# EasyEDA Pro project 控制箱转接板.eprj

# Schematic 控制箱转接板
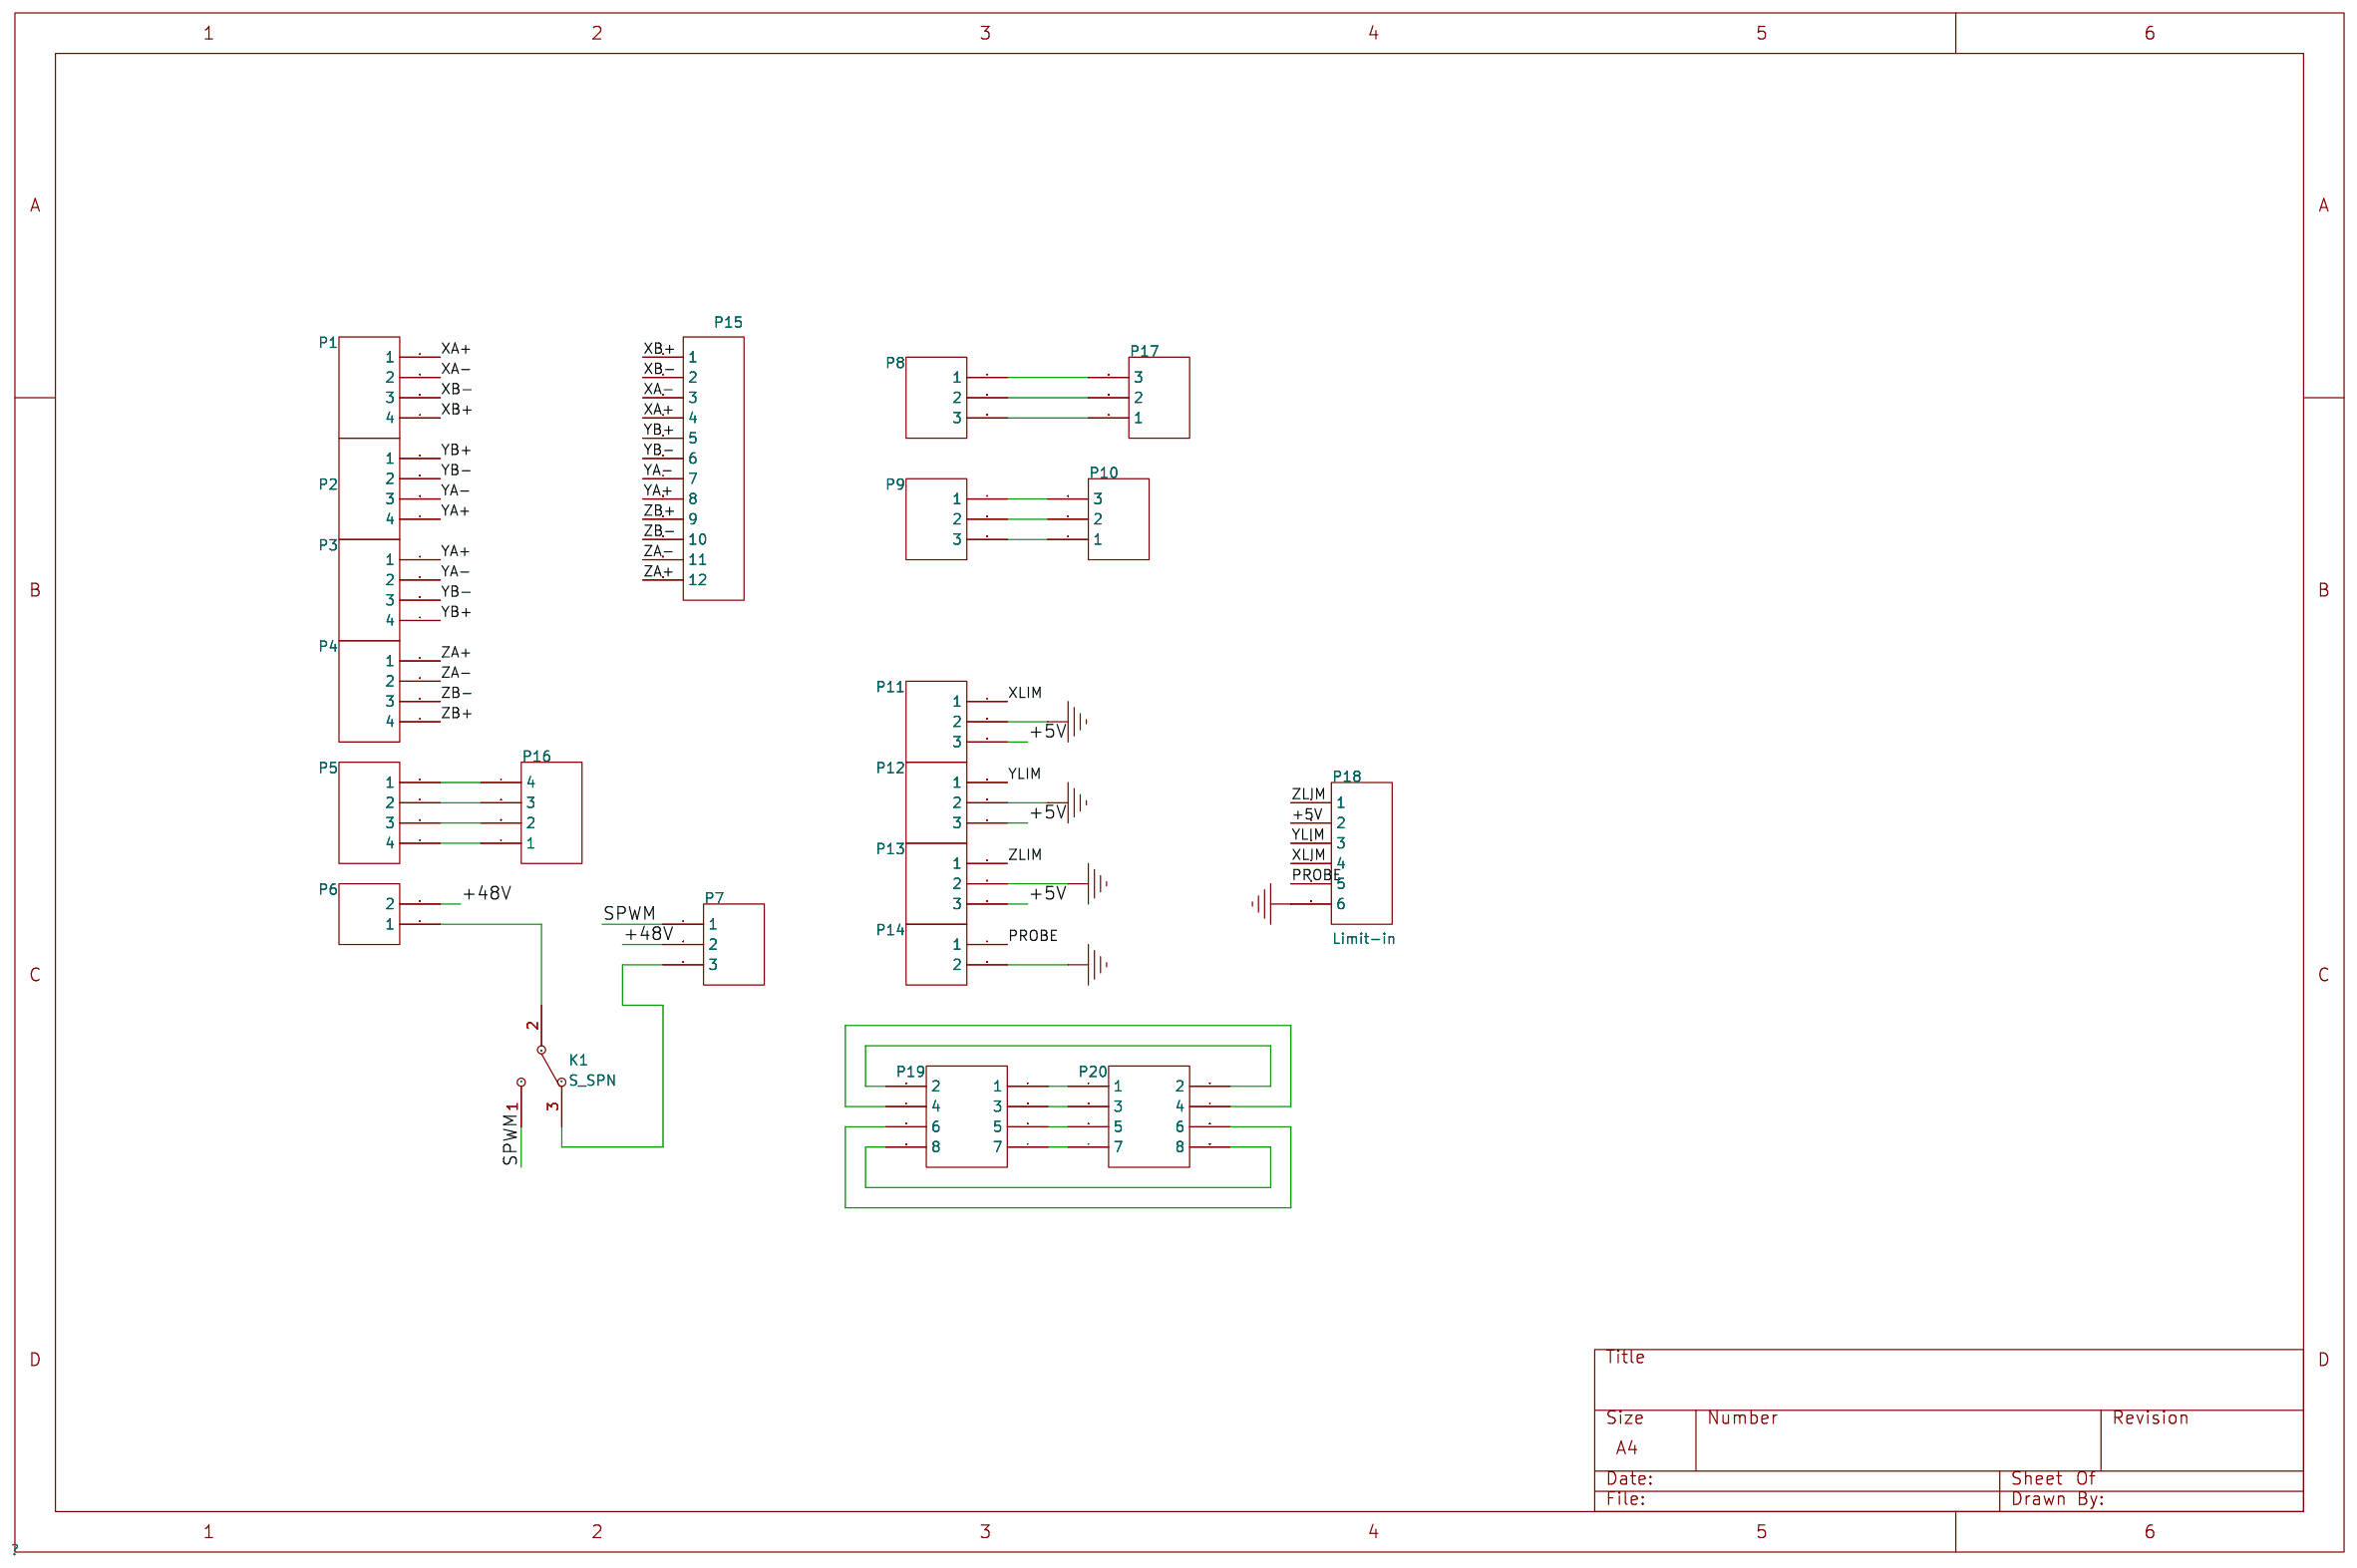
[diagram p0: schematic sheet]

## Parts
K1  S_SPN  [SW-TH_SS-12D10L3]
P1  X-out  [CONN-TH_4P-P5.00_KF2EDGVC-5.08-4P]
P2  Y1-out  [CONN-TH_4P-P5.00_KF2EDGVC-5.08-4P]
P3  Y2-out  [CONN-TH_4P-P5.00_KF2EDGVC-5.08-4P]
P4  Z-out  [CONN-TH_4P-P5.00_KF2EDGVC-5.08-4P]
P5  Aout  [CONN-TH_4P-P5.00_KF2EDGVC-5.08-4P]
P6  SPN-out  [CONN-TH_2P-P5.00_KF2EDGVC-5.08-2P]
P7  SPN-in  [CONN-TH_3P-P5.00_KF2EDGVC-5.08-3P]
P8  Laser-out  [CONN-TH_3P-P5.00_KF2EDGVC-5.08-3P]
P9  BL-out  [CONN-TH_3P-P5.00_KF2EDGVC-5.08-3P]
P10  BL-in  [CONN-TH_3P-P5.00_KF2EDGVC-5.08-3P]
P11  XLimt-out  [CONN-TH_3P-P5.00_KF2EDGVC-5.08-3P]
P12  YLimt-out  [CONN-TH_3P-P5.00_KF2EDGVC-5.08-3P]
P13  ZLimt-out  [CONN-TH_3P-P5.00_KF2EDGVC-5.08-3P]
P14  Probe-out  [CONN-TH_2P-P5.00_KF2EDGVC-5.08-2P]
P15  XYZAxis  [HDR1X12_CON]
P16  Ain  [HDR1X4_CON]
P17  Laser-in  [HDR1X3_CON]
P18  Limit-in  [HDR1X6_CON]
P19  Offline-out  [IDC-TH_MTB110-08S - duplicate]
P20  Offline-in  [IDC-TH_MTB110-08S - duplicate]

## Library data of the parts
K1 = S_SPN: SS-12D10L5; Published: 24-Mar-1999; LatestRevisionDate: 17-Dec-2003; LatestRevisionNote: Schematic revised, PCB Footprint replaced.; DatasheetVersion: 05-Dec-2000; PackageReference: TL36WW15050; Publisher: Altium Limited; PackageDescription: Switch; 4 Leads; ComponentLink1Description: Manufacturer Link; ComponentLink1URL: http://www.apem.com; Design Item ID: SW-SPDT; Library Name: Miscellaneous Devices
P1 = X-out: KF2EDGVC-5.0-4P，直插; LatestRevisionDate: 17-Jul-2002; LatestRevisionNote: Re-released for DXP Platform.; Publisher: Altium Limited; Origin Footprint 2: HDR1X4H; Origin Footprint 3: CONN-TH_4P-P3.81_KF2EDGV-3.81-4P; Origin Footprint 1: CONN-TH_4P-P5.00_KF2EDGVC-5.0-4P; Design Item ID: Header 4H; Library Name: Miscellaneous Connectors
P2 = Y1-out: KF2EDGVC-5.0-4P，直插; LatestRevisionDate: 17-Jul-2002; LatestRevisionNote: Re-released for DXP Platform.; Publisher: Altium Limited; Origin Footprint 2: HDR1X4H; Origin Footprint 3: CONN-TH_4P-P3.81_KF2EDGV-3.81-4P; Origin Footprint 1: CONN-TH_4P-P5.00_KF2EDGVC-5.0-4P; Design Item ID: Header 4H; Library Name: Miscellaneous Connectors
P3 = Y2-out: KF2EDGVC-5.0-4P，直插; LatestRevisionDate: 17-Jul-2002; LatestRevisionNote: Re-released for DXP Platform.; Publisher: Altium Limited; Origin Footprint 2: HDR1X4H; Origin Footprint 3: CONN-TH_4P-P3.81_KF2EDGV-3.81-4P; Origin Footprint 1: CONN-TH_4P-P5.00_KF2EDGVC-5.0-4P; Design Item ID: Header 4H; Library Name: Miscellaneous Connectors
P4 = Z-out: KF2EDGVC-5.0-4P，直插; LatestRevisionDate: 17-Jul-2002; LatestRevisionNote: Re-released for DXP Platform.; Publisher: Altium Limited; Origin Footprint 2: HDR1X4H; Origin Footprint 3: CONN-TH_4P-P3.81_KF2EDGV-3.81-4P; Origin Footprint 1: CONN-TH_4P-P5.00_KF2EDGVC-5.0-4P; Design Item ID: Header 4H; Library Name: Miscellaneous Connectors
P5 = Aout: KF2EDGVC-5.0-4P，直插; LatestRevisionDate: 17-Jul-2002; LatestRevisionNote: Re-released for DXP Platform.; Publisher: Altium Limited; Origin Footprint 2: HDR1X4H; Origin Footprint 3: CONN-TH_4P-P3.81_KF2EDGV-3.81-4P; Origin Footprint 1: CONN-TH_4P-P5.00_KF2EDGVC-5.0-4P; Design Item ID: Header 4H; Library Name: Miscellaneous Connectors
P6 = SPN-out: KF2EDGVC-5.0-2P，直插; LatestRevisionDate: 17-Jul-2002; LatestRevisionNote: Re-released for DXP Platform.; Publisher: Altium Limited; Origin Footprint 2: HDR1X2H; Origin Footprint 3: CONN-TH_2P-P3.81_KF2EDGV-3.81-2P; Origin Footprint 1: CONN-TH_2P-P5.00_KF2EDGVC-5.0-2P; Design Item ID: Header 2H; Library Name: Miscellaneous Connectors
P7 = SPN-in: KF2EDGVC-5.0-3P，直插; LatestRevisionDate: 17-Jul-2002; LatestRevisionNote: Re-released for DXP Platform.; Publisher: Altium Limited; Origin Footprint 2: HDR1X3H; Origin Footprint 3: CONN-TH_3P-P3.81_KF2EDGV-3.81-3P; Origin Footprint 4: SW-TH_SS-12F44-GX; Origin Footprint 1: CONN-TH_3P-P5.00_KF2EDGVC-5.0-3P; Design Item ID: Header 3H; Library Name: Miscellaneous Connectors
P8 = Laser-out: KF2EDGVC-5.0-3P，直插; LatestRevisionDate: 17-Jul-2002; LatestRevisionNote: Re-released for DXP Platform.; Publisher: Altium Limited; Origin Footprint 2: HDR1X3H; Origin Footprint 3: CONN-TH_3P-P3.81_KF2EDGV-3.81-3P; Origin Footprint 1: CONN-TH_3P-P5.00_KF2EDGVC-5.0-3P; Design Item ID: Header 3H; Library Name: Miscellaneous Connectors
P9 = BL-out: KF2EDGVC-5.0-3P，直插; LatestRevisionDate: 17-Jul-2002; LatestRevisionNote: Re-released for DXP Platform.; Publisher: Altium Limited; Origin Footprint 2: HDR1X3H; Origin Footprint 3: CONN-TH_3P-P3.81_KF2EDGV-3.81-3P; Origin Footprint 1: CONN-TH_3P-P5.00_KF2EDGVC-5.0-3P; Design Item ID: Header 3H; Library Name: Miscellaneous Connectors
P10 = BL-in: KF2EDGVC-5.0-3P，直插; LatestRevisionDate: 17-Jul-2002; LatestRevisionNote: Re-released for DXP Platform.; Publisher: Altium Limited; Origin Footprint 2: HDR1X3H; Origin Footprint 3: CONN-TH_3P-P3.81_KF2EDGV-3.81-3P; Origin Footprint 4: HDR1X3_CON; Origin Footprint 1: CONN-TH_3P-P5.00_KF2EDGVC-5.0-3P; Design Item ID: Header 3H; Library Name: Miscellaneous Connectors
P11 = XLimt-out: KF2EDGVC-5.0-3P，直插; LatestRevisionDate: 17-Jul-2002; LatestRevisionNote: Re-released for DXP Platform.; Publisher: Altium Limited; Origin Footprint 2: HDR1X3H; Origin Footprint 3: CONN-TH_3P-P3.81_KF2EDGV-3.81-3P; Origin Footprint 1: CONN-TH_3P-P5.00_KF2EDGVC-5.0-3P; Design Item ID: Header 3H; Library Name: Miscellaneous Connectors
P12 = YLimt-out: KF2EDGVC-5.0-3P，直插; LatestRevisionDate: 17-Jul-2002; LatestRevisionNote: Re-released for DXP Platform.; Publisher: Altium Limited; Origin Footprint 2: HDR1X3H; Origin Footprint 3: CONN-TH_3P-P3.81_KF2EDGV-3.81-3P; Origin Footprint 1: CONN-TH_3P-P5.00_KF2EDGVC-5.0-3P; Design Item ID: Header 3H; Library Name: Miscellaneous Connectors
P13 = ZLimt-out: KF2EDGVC-5.0-3P，直插; LatestRevisionDate: 17-Jul-2002; LatestRevisionNote: Re-released for DXP Platform.; Publisher: Altium Limited; Origin Footprint 2: HDR1X3H; Origin Footprint 3: CONN-TH_3P-P3.81_KF2EDGV-3.81-3P; Origin Footprint 1: CONN-TH_3P-P5.00_KF2EDGVC-5.0-3P; Design Item ID: Header 3H; Library Name: Miscellaneous Connectors
P14 = Probe-out: Header, 2-Pin, Right Angle; LatestRevisionDate: 17-Jul-2002; LatestRevisionNote: Re-released for DXP Platform.; Publisher: Altium Limited; Origin Footprint 2: HDR1X2H; Origin Footprint 3: CONN-TH_2P-P3.81_KF2EDGV-3.81-2P; Origin Footprint 1: CONN-TH_2P-P5.00_KF2EDGVC-5.0-2P; Design Item ID: Header 2H; Library Name: Miscellaneous Connectors
P15 = XYZAxis: 2.54立式直插12P; LatestRevisionDate: 17-Jul-2002; LatestRevisionNote: Re-released for DXP Platform.; Publisher: Altium Limited; Origin Footprint 2: HDR1X12H; Origin Footprint 3: HDR1X12H; Design Item ID: Header 12H; Library Name: Miscellaneous Connectors
P16 = Ain: 2.54立式直插4P; LatestRevisionDate: 17-Jul-2002; LatestRevisionNote: Re-released for DXP Platform.; Publisher: Altium Limited; Origin Footprint 2: HDR1X4H-3d; Design Item ID: Header 4H; Library Name: Miscellaneous Connectors
P17 = Laser-in: 2.54立式直插3P; LatestRevisionDate: 17-Jul-2002; LatestRevisionNote: Re-released for DXP Platform.; Publisher: Altium Limited; Design Item ID: Header 3H; Library Name: cnc3040控制箱端子
P18 = Limit-in: 2.54立式直插6P; LatestRevisionDate: 17-Jul-2002; LatestRevisionNote: Re-released for DXP Platform.; Publisher: Altium Limited; Origin Footprint 2: HDR1X6; Design Item ID: Header 6; Library Name: Miscellaneous Connectors
P19 = Offline-out: IDC连接器（牛角/简牛）2x4P; LatestRevisionDate: 17-Jul-2002; LatestRevisionNote: Re-released for DXP Platform.; Publisher: Altium Limited; Origin Footprint 2: MHDR2X4; Design Item ID: MHDR2X4; Library Name: 原理图库
P20 = Offline-in: IDC连接器（牛角/简牛）2x4P; LatestRevisionDate: 17-Jul-2002; LatestRevisionNote: Re-released for DXP Platform.; Publisher: Altium Limited; Origin Footprint 2: MHDR2X4; Design Item ID: MHDR2X4; Library Name: 原理图库

## Nets
+5V: P11.3 P12.3 P13.3(+5V) P18.2
+48V: P6.2 P7.2
GND: P11.2 P12.2 P13.2(GND) P14.2 P18.6
PROBE: P14.1 P18.5
SPWM: K1.1 P7.1
XA+: P1.1 P15.4
XA-: P1.2 P15.3
XB+: P1.4 P15.1
XB-: P1.3 P15.2
XLIM: P11.1 P18.4
YA+: P2.4 P3.1 P15.8
YA-: P2.3 P3.2 P15.7
YB+: P2.1 P3.4 P15.5
YB-: P2.2 P3.3 P15.6
YLIM: P12.1 P18.3
ZA+: P4.1 P15.12
ZA-: P4.2 P15.11
ZB+: P4.4 P15.9
ZB-: P4.3 P15.10
ZLIM: P13.1(IO) P18.1
NETK1_2: K1.2 P6.1
NETK1_3: K1.3 P7.3
NETP5_1: P5.1 P16.4
NETP5_2: P5.2 P16.3
NETP5_3: P5.3 P16.2
NETP5_4: P5.4 P16.1
NETP8_1: P8.1 P17.3
NETP8_2: P8.2 P17.2
NETP8_3: P8.3 P17.1
NETP9_1: P9.1 P10.3
NETP9_2: P9.2 P10.2
NETP9_3: P9.3 P10.1
NETP19_1: P19.1 P20.1
NETP19_2: P19.2 P20.2
NETP19_3: P19.3 P20.3
NETP19_4: P19.4 P20.4
NETP19_5: P19.5 P20.5
NETP19_6: P19.6 P20.6
NETP19_7: P19.7 P20.7
NETP19_8: P19.8 P20.8

# Board 控制箱转接板
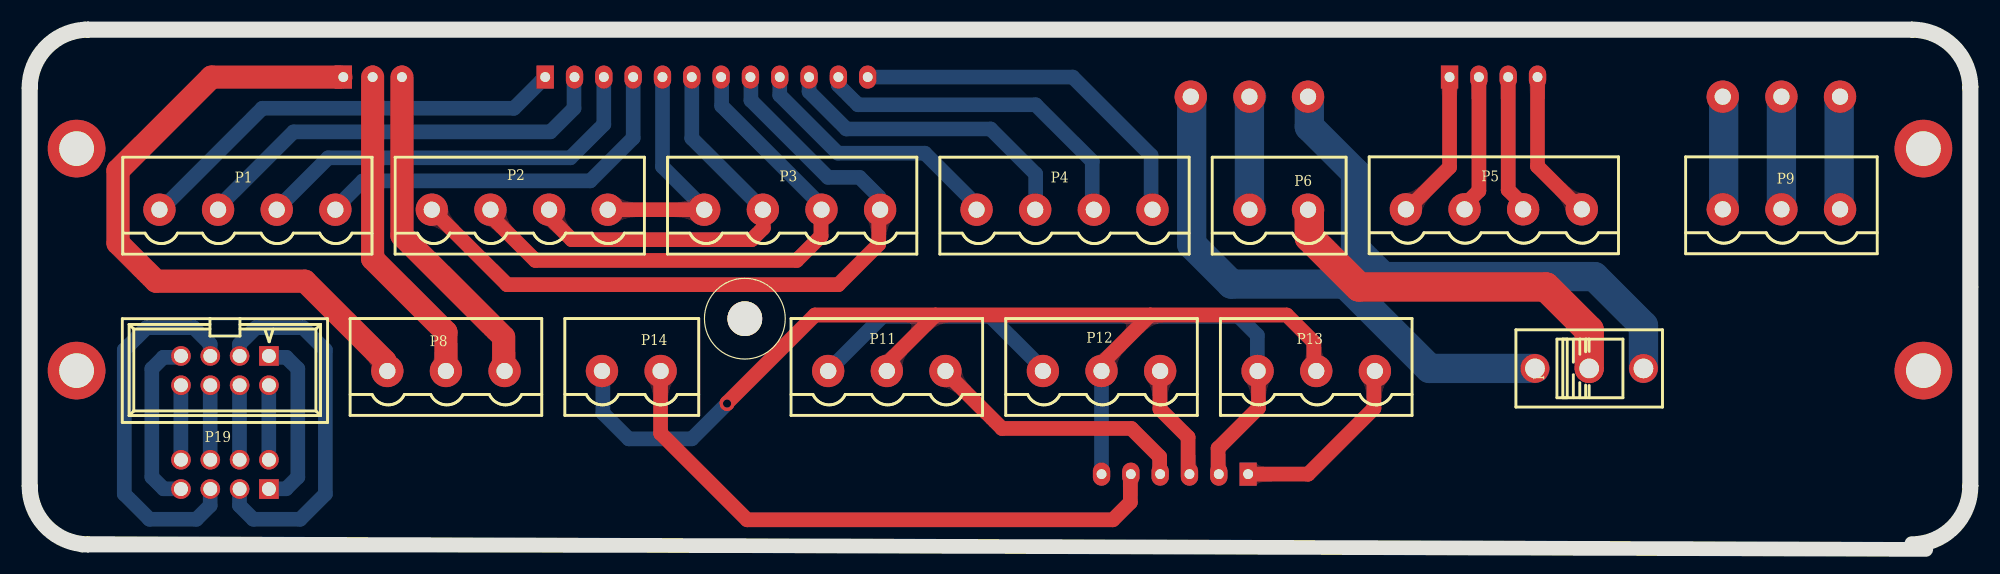
[diagram p1: board, top side]
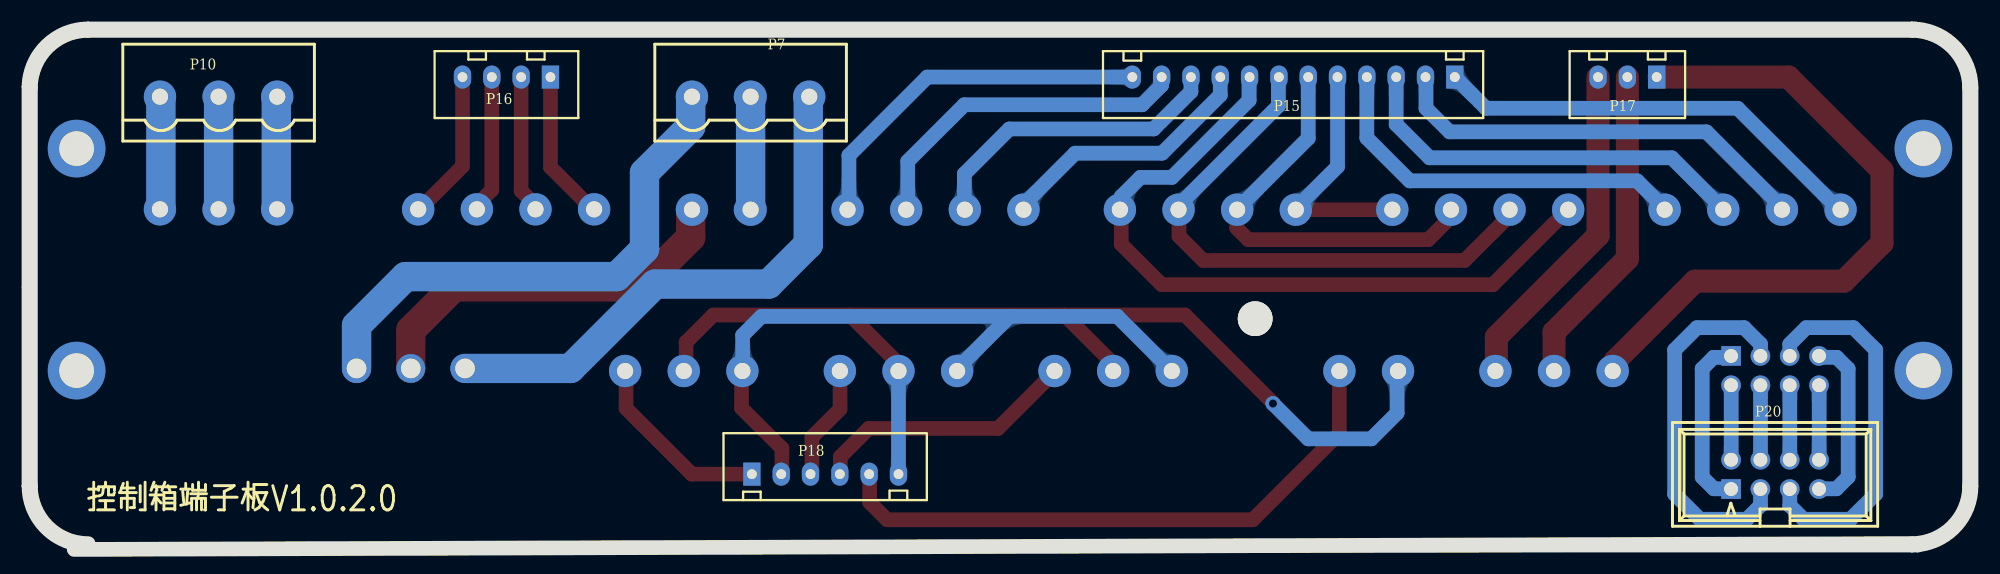
[diagram p2: board, bottom side, seen from below]

Outline 169.27 x 45.77 mm; copper layers: Top Layer, Bottom Layer. Coordinates in mm from the lower left corner of the outline.
Outline path: 5.62,45.77 5.39,45.77 arc(5.32,45.77) 5.26,45.76 arc(1.52,43.99) 0,40.14 0,5.64 arc(1.39,1.93) 4.88,0.05 arc(5,0.01) 5.13,0 5.59,0 arc(5.61,0) 5.64,0 arc(5.64,0) 5.65,0 163.62,0 arc(163.63,0) 163.64,0 arc(163.66,0) 163.68,0 164.46,0 arc(164.66,0.03) 164.84,0.13 ; 5.62,45.77 arc(5.63,45.77) 5.64,45.77 ; 5.62,45.77 arc(5.63,45.77) 5.64,45.77 163.64,45.77 arc(163.64,45.77) 163.64,45.77 arc(167.58,44.17) 169.27,40.26 arc(169.27,40.24) 169.27,40.22 169.27,5.64 arc(168.03,2.1) 164.84,0.13 ; 164.84,0.13 5.64,0.64 arc(2.1,2.1) 0.64,5.64 0.64,40.14 arc(2.1,43.67) 5.64,45.14 163.64,45.14 arc(167.17,43.67) 168.64,40.14 168.64,5.64 arc(167.17,2.1) 163.64,0.64
Stack: Top Layer 0.0356mm / Dielectric 1 0.32mm FR-4 er 4.8 / Bottom Layer 0.0356mm

## Design rules (mm)
net Ain: cnc3040控制箱端子5.0
net Aout: cnc3040控制箱端子5.0
net Laser-out: cnc3040控制箱端子5.0
net Limit-in: cnc3040控制箱端子5.0
net Offline-in: cnc3040控制箱端子5.0
net Offline-out: cnc3040控制箱端子5.0
net SPN-in: cnc3040控制箱端子5.0
net SPN-out: cnc3040控制箱端子5.0
net XLimt-out: cnc3040控制箱端子5.0
net Y1-out: cnc3040控制箱端子5.0
net Y2-out: cnc3040控制箱端子5.0
net YLimt-out: cnc3040控制箱端子5.0
net Z-out: cnc3040控制箱端子5.0
net ZLimt-out: cnc3040控制箱端子5.0
net XYZAxis: cnc3040控制箱端子5.0
net Laser-in: cnc3040控制箱端子5.0
net X-out: cnc3040控制箱端子5.0
net S_Spn: cnc3040控制箱端子5.0
net BL-in: cnc3040控制箱端子5.0
net BL-out: cnc3040控制箱端子5.0
net P14: cnc3040控制箱端子5.0
net K1: Inside Board Components
net P20: Inside Board Components
net P19: Inside Board Components
net P16: Inside Board Components
net P6: Inside Board Components
net P7: Inside Board Components
net P13: Inside Board Components
net P4: Inside Board Components
net P12: Inside Board Components
net P3: Inside Board Components
net P2: Inside Board Components
net P11: Inside Board Components
net P8: Inside Board Components
net P5: Inside Board Components
net P18: Inside Board Components
net P15: Inside Board Components
net P17: Inside Board Components
net P1: Inside Board Components
net P10: Inside Board Components
net P9: Inside Board Components
spacing Clearance (default): track to track 0.254, other pairs 0.254 to 0.254
track width Width (default): min 0.254, default 0.254, max 2.54
differential pair DiffPairsRouting (default): width min 0.381, default 0.381, max 0.381; gap min 0.254, default 0.254
via RoutingVias (default): diameter min 1.27, default 2, max 2; hole min 0.711, default 1.4, max 1.4

## Placement (name value [footprint] x y rotation side)
K1  S_SPN  [SW-TH_SS-12D10L3]  135.68 15.83 0 top
NOREF  -  [Pad_ie3]  164.64 34.89 0 top
NOREF#2  -  [Pad_ie2]  62.53 20.14 0 top
NOREF#3  -  [Pad_ie6]  164.64 15.64 0 top
NOREF#4  -  [Pad_ie4]  4.64 15.64 0 top
NOREF#5  -  [Pad_ie5]  4.64 34.89 0 top
P1  X-out  [CONN-TH_4P-P5.00_KF2EDGVC-5.08-4P]  19.43 29.59 180 top
P2  Y1-out  [CONN-TH_4P-P5.00_KF2EDGVC-5.08-4P]  43.03 29.59 180 top
P3  Y2-out  [CONN-TH_4P-P5.00_KF2EDGVC-5.08-4P]  66.63 29.59 180 top
P4  Z-out  [CONN-TH_4P-P5.00_KF2EDGVC-5.08-4P]  90.23 29.59 180 top
P5  Aout  [CONN-TH_4P-P5.00_KF2EDGVC-5.08-4P]  127.42 29.62 180 top
P6  SPN-out  [CONN-TH_2P-P5.00_KF2EDGVC-5.08-2P]  111.32 29.59 180 top
P7  SPN-in  [CONN-TH_3P-P5.00_KF2EDGVC-5.08-3P]  106.24 39.39 0 bottom
P8  Laser-out  [CONN-TH_3P-P5.00_KF2EDGVC-5.08-3P]  36.63 15.6 180 top
P9  BL-out  [CONN-TH_3P-P5.00_KF2EDGVC-5.08-3P]  152.34 29.62 180 top
P10  BL-in  [CONN-TH_3P-P5.00_KF2EDGVC-5.08-3P]  152.33 39.39 0 bottom
P11  XLimt-out  [CONN-TH_3P-P5.00_KF2EDGVC-5.08-3P]  74.83 15.6 180 top
P12  YLimt-out  [CONN-TH_3P-P5.00_KF2EDGVC-5.08-3P]  93.43 15.6 180 top
P13  ZLimt-out  [CONN-TH_3P-P5.00_KF2EDGVC-5.08-3P]  112.03 15.6 180 top
P14  Probe-out  [CONN-TH_2P-P5.00_KF2EDGVC-5.08-2P]  55.23 15.6 180 top
P15  XYZAxis  [HDR1X12_CON]  57.93 41.09 0 bottom
P16  Ain  [HDR1X4_CON]  123.58 41.09 0 bottom
P17  Laser-in  [HDR1X3_CON]  30.28 41.09 0 bottom
P18  Limit-in  [HDR1X6_CON]  101.05 6.66 180 bottom
P19  Offline-out  [IDC-TH_MTB110-08S - duplicate]  17.49 15.64 180 top
P20  Offline-in  [IDC-TH_MTB110-08S - duplicate]  17.49 6.64 180 bottom

## Footprints (pads in the part's own frame, mm; a bottom-side part is the same pattern mirrored in y, then rotated)
CONN-TH_2P-P5.00_KF2EDGVC-5.08-2P
  round 2.8 hole 1.4: 1(0,0) 2(5.08,0)
CONN-TH_3P-P5.00_KF2EDGVC-5.08-3P
  round 2.8 hole 1.4: 1(-5.08,0) 2(0,0) 3(5.08,0)
CONN-TH_4P-P5.00_KF2EDGVC-5.08-4P
  round 2.8 hole 1.4: 1(-7.62,0) 2(-2.54,0) 3(2.54,0) 4(7.62,0)
HDR1X3_CON
  rect 1.5x2 hole 0.85: 1(-2.54,0)
  oval 1.5x2 hole 0.85: 2(0,0) 3(2.54,0)
HDR1X4_CON
  rect 1.5x2 hole 0.85: 1(0,0)
  oval 1.5x2 hole 0.85: 2(2.54,0) 3(5.08,0) 4(7.62,0)
HDR1X6_CON
  rect 1.5x2 hole 0.85: 1(-5.08,0)
  oval 1.5x2 hole 0.85: 2(-2.54,0) 3(0,0) 4(2.54,0) 5(5.08,0) 6(7.62,0)
HDR1X12_CON
  rect 1.5x2 hole 0.85: 1(-12.7,0)
  oval 1.5x2 hole 0.85: 2(-10.16,0) 3(-7.62,0) 4(-5.08,0) 5(-2.54,0) 6(0,0) 7(2.54,0) 8(5.08,0) 9(7.62,0) 10(10.16,0) 11(12.7,0) 12(15.24,0)
IDC-TH_MTB110-08S - duplicate
  rect 1.7x1.7 hole 1.2: 1(-3.81,-1.27)
  round 1.7 hole 1.2: 2(-3.81,1.27) 3(-1.27,-1.27) 4(-1.27,1.27) 5(1.27,-1.27) 6(1.27,1.27) 7(3.81,-1.27) 8(3.81,1.27)
Pad_ie2
  round 3 hole 3: 3(0,0)
Pad_ie3
  round 5 hole 3: 5(0,0)
Pad_ie4
  round 5 hole 3: 4(0,0)
Pad_ie5
  round 5 hole 3: 3(0,0)
Pad_ie6
  round 5 hole 3: 5(0,0)
SW-TH_SS-12D10L3
  round 2.5 hole 1.7: 1(-4.7,0) 2(0,0) 3(4.7,0)

## Nets
As in the schematic, except:
X LIM: P11.1 P18.4
Y LIM: P12.1 P18.3
Z LIM: P13.1 P18.1

Pads without a net: NOREF 5; NOREF#2 3; NOREF#3 5; NOREF#4 4; NOREF#5 3

## Via types
v1: diameter 1.27, hole 0.711, Top Layer to Bottom Layer, 1 via

## Routing (per net, layer and track width the routed paths; a pad name or vN(x,y) marks a point on that pad's centre or on a via; arc(x,y) is an arc through that point)
+5V: length 60.1
  Top Layer w1.27: 106.53,15.6 107.03,15.1 107.03,12.4 103.53,8.9 103.53,7.1
  Bottom Layer w1.27: 83.79,20.34 87.93,16.2 87.93,15.6 ; 83.79,20.34 105.29,20.34 106.93,18.7 106.93,16 106.53,15.6 ; 83.79,20.34 74.47,20.34 69.73,15.6 69.33,15.6
+48V: length 10
  Bottom Layer w2.54: 106.43,39.39 106.24,39.2 106.24,29.78 106.43,29.59
GND: length 96.8
  Top Layer w1.27: 79.05,20.46 68.61,20.46 60.99,12.84 v1(60.99,12.78) ; 79.05,20.46 97.65,20.46 ; 79.05,20.46 74.33,15.74 74.33,15.6 ; 97.65,20.46 109.47,20.46 111.83,18.1 111.83,15.9 111.53,15.6 ; 97.65,20.46 92.93,15.74 92.93,15.6
  Bottom Layer w1.27: P18.6 P12.2 ; 50.23,15.6 50.23,11.96 52.47,9.72 57.93,9.72 v1(60.99,12.78)
NETK1_2: length 33.2
  Top Layer w2.54: 111.43,29.49 111.43,27.19 115.73,22.89 131.93,22.89 135.68,19.14 K1.2
NETK1_3: length 46.3
  Bottom Layer w2.54: 111.43,39.39 111.43,36.79 115.43,32.79 115.43,26.19 117.83,23.79 136.13,23.79 140.38,19.54 K1.3
NETP5_1: length 13
  Top Layer w1.27: P16.4 131.2,33.35 134.93,29.62
NETP5_2: length 12
  Top Layer w1.27: P16.3 128.66,31.3 129.93,30.04 129.93,29.62
NETP5_3: length 12
  Top Layer w1.27: 124.93,29.62 124.93,30.04 126.12,31.23 P16.2
NETP5_4: length 13
  Top Layer w1.27: 119.93,29.62 123.58,33.27 P16.1
NETP8_1: length 29.1
  Top Layer w2: P17.3 32.82,27.35 41.63,18.54 41.63,15.6
NETP8_2: length 28.1
  Top Layer w2: P8.2 36.63,18.98 30.28,25.33 P17.2
NETP8_3: length 57.3
  Top Layer w2: 31.63,15.6 31.34,15.89 31.34,16.47 24.42,23.39 11.52,23.39 8.22,26.69 8.22,32.99 16.32,41.09 27.53,41.09
NETP9_1: length 9.8
  Bottom Layer w2.54: 157.33,29.62 157.33,39.39
NETP9_2: length 9.8
  Bottom Layer w2.54: 152.33,29.62 152.33,39.39
NETP9_3: length 9.8
  Bottom Layer w2.54: 147.33,29.62 147.33,39.39
NETP19_1: length 15.3
  Bottom Layer w1.27: 21.29,16.87 21.37,16.79 22.81,16.79 23.8,15.8 23.8,6.41 22.79,5.39 21.31,5.39 21.29,5.37
NETP19_2: length 6.4
  Bottom Layer w1.27: 21.29,7.91 21.29,14.33
NETP19_3: length 32.7
  Bottom Layer w1.27: 18.75,16.87 18.75,17.94 20.17,19.36 24.26,19.36 26.19,17.43 26.19,4.93 24,2.75 19.94,2.75 18.75,3.94 18.75,5.37
NETP19_4: length 6.4
  Bottom Layer w1.27: 18.75,7.91 18.75,14.33
NETP19_5: length 32.7
  Bottom Layer w1.27: 16.21,16.87 16.21,17.94 14.79,19.36 10.7,19.36 8.77,17.43 8.77,4.93 10.95,2.75 15.02,2.75 16.21,3.94 16.21,5.37
NETP19_6: length 6.4
  Bottom Layer w1.27: 16.21,7.91 16.21,14.33
NETP19_7: length 15.3
  Bottom Layer w1.27: 13.67,16.87 13.59,16.79 12.15,16.79 11.16,15.8 11.16,6.41 12.17,5.39 13.65,5.39 13.67,5.37
NETP19_8: length 6.4
  Bottom Layer w1.27: 13.67,7.91 13.67,14.33
PROBE: length 52.3
  Top Layer w1.27: P14.1 55.23,10.2 62.73,2.7 94.41,2.7 95.93,4.22 95.93,6.61 P18.5
SPWM: length 46.8
  Bottom Layer w2.54: 101.24,39.2 101.24,26.58 104.68,23.14 114.53,23.14 121.85,15.83 K1.1
X LIM: length 23.7
  Top Layer w1.27: P18.4 98.47,6.7 98.47,8.16 96.01,10.62 84.81,10.62 79.83,15.6 79.33,15.6
XA+: length 33.8
  Bottom Layer w1.27: P15.4 52.85,35.81 49.14,32.09 29.43,32.09 26.93,29.59
XA-: length 35.5
  Bottom Layer w1.27: 21.93,29.59 26.43,34.09 47.42,34.09 50.31,36.98 P15.3
XB+: length 38.2
  Bottom Layer w1.27: P15.1 45.23,40.84 45.12,40.72 44.87,40.72 42.53,38.38 20.73,38.38 11.93,29.59
XB-: length 37.3
  Bottom Layer w1.27: P15.2 47.73,41.04 47.73,38.38 45.68,36.34 23.43,36.34 16.93,29.84 16.93,29.59
Y LIM: length 9.6
  Top Layer w1.27: 98.43,15.6 98.49,15.54 98.49,12.3 100.93,9.86 100.93,7.04
YA+: length 63.5
  Top Layer w1.27: 74.13,29.59 74.13,26.6 70.62,23.09 41.93,23.09 35.53,29.49 35.53,29.59
  Bottom Layer w1.27: 74.13,29.59 74.13,30.73 72.47,32.39 69.74,32.39 63.06,39.07 63.06,41.04 P15.8
YA-: length 49
  Top Layer w1.27: 69.13,29.59 69.13,27.3 67.02,25.19 44.38,25.19 40.53,29.04 40.53,29.59
  Bottom Layer w1.27: P15.7 60.52,41.04 60.52,38.59 69.09,30.03 69.09,29.59
YB+: length 21.6
  Top Layer w1.27: 50.53,29.59 59.13,29.59
  Bottom Layer w1.27: P15.5 55.39,33.33 59.13,29.59
YB-: length 36.1
  Top Layer w1.27: 64.13,29.59 64.13,28 63.12,26.99 47.53,26.99 45.53,28.99 45.53,29.59
  Bottom Layer w1.27: P15.6 57.93,35.79 64.13,29.59
Z LIM: length 16.7
  Top Layer w1.27: P18.1 111.33,6.66 117.03,12.36 117.03,15.1 116.53,15.6
ZA+: length 32.1
  Bottom Layer w1.27: 97.73,29.59 97.73,34.3 90.93,41.09 P15.12
ZA-: length 29.7
  Bottom Layer w1.27: P15.11 70.63,40.39 72.33,38.69 87.72,38.69 92.63,33.78 92.63,29.69 92.73,29.59
ZB+: length 23
  Bottom Layer w1.27: P15.9 65.55,39.52 70.59,34.49 78.12,34.49 82.73,29.89 82.73,29.59
ZB-: length 27
  Bottom Layer w1.27: 87.73,29.59 87.73,32.69 83.82,36.59 71.33,36.59 68.09,39.82 P15.10

Small or netless copper shapes (teardrops, artwork), in the pictures only: 30 on Top Layer, 39 on Bottom Layer

## Text on the board
Bottom Silkscreen Layer: 控制箱端子板V1.0.2.0
